# Altium schematic sheet CT_v02.SchDoc
size 420 x 297 mm; DrawnBy: Рулько В.; SheetNumber: 1; SheetTotal: 1; Title1str: Вимірювач струму; PageSetup: Record=PageOptions|CenterHorizontal=False|CenterVertical=False|PrintScale=0.95|XCorrection=0.00|YCorrection=0.00|PrintKind=1|BorderSize=5000000|LeftOffset=0|BottomOffset=0|Orientation=1|PaperLength=1000|PaperWidth=1000|Scale=100|PaperSource=15|PrintQuality=600|MediaType=1|DitherType=10|PaperKind=A4|PrintScaleMode=1; Title2str: широкодіапазонний; DocumentType1str: Схема електрична; DocumentType2str: принципрва; ProjectNameForBOM: Вимірювач струму широкодіапазонний
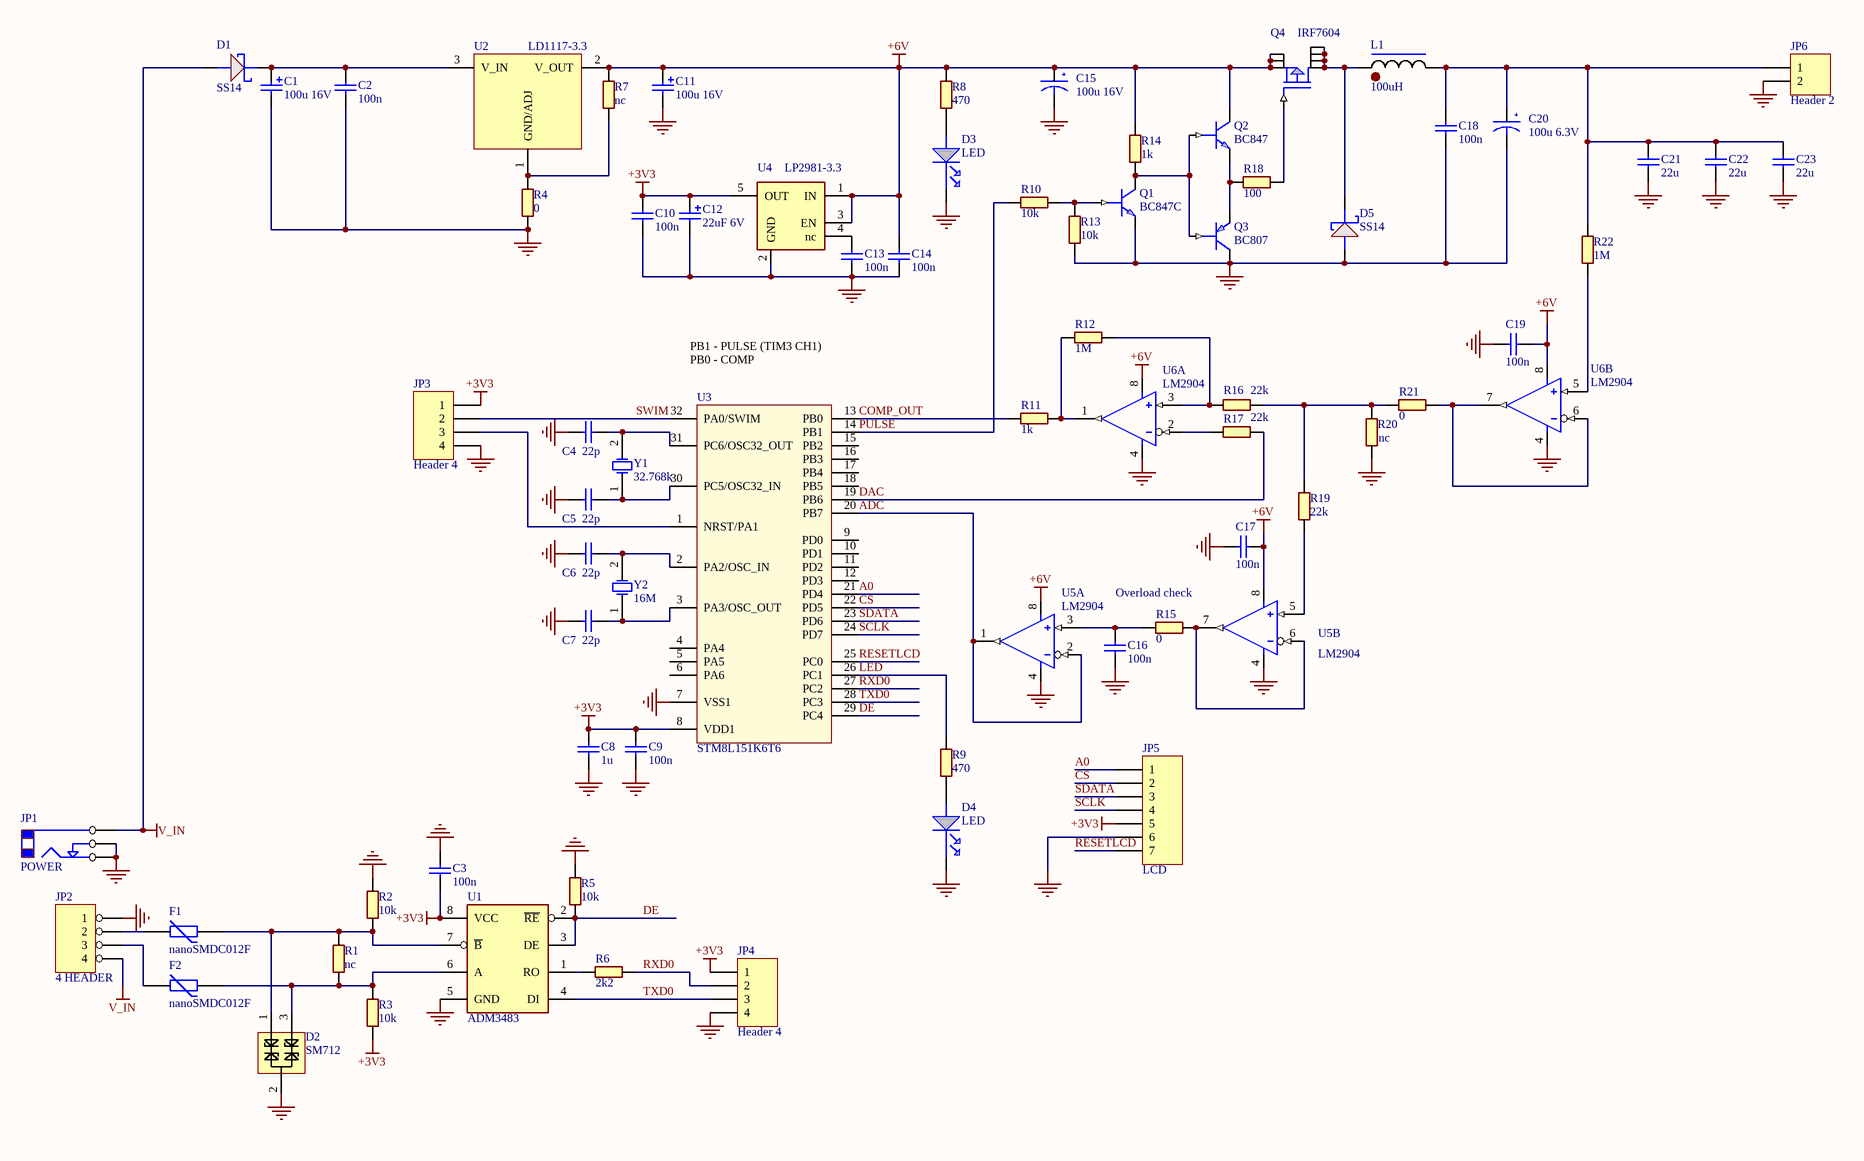
[diagram p0: CT_v02.SchDoc]

## Parts
C1  100u 16V  [C_TANTAL_D]
C2  100n  [C-0603]
C3  100n  [C-0603]
C4  22p  [C-0603]
C5  22p  [C-0603]
C6  22p  [C-0603]
C7  22p  [C-0603]
C8  1u  [C-0603]
C9  100n  [C-0603]
C10  100n  [C-0603]
C11  100u 16V  [C_TANTAL_D]
C12  22uF 6V  [C_TANTAL_A]
C13  100n  [C-0603]
C14  100n  [C-0603]
C15  100u 16V  [C_TANTAL_D]
C16  100n  [C-0603]
C17  100n  [C-0603]
C18  100n  [C-0603]
C19  100n  [C-0603]
C20  100u 6.3V  [C_TANTAL_B]
C21  22u  [C-1206]
C22  22u  [C-1206]
C23  22u  [C-1206]
D1  SS14  [D-SMA]
D2  SM712  [SOT-23]
D3  LED  [LED_0805]
D4  LED  [LED_0805]
D5  SS14  [D-SMA]
F1  nanoSMDC012F  [R-1206]
F2  nanoSMDC012F  [R-1206]
JP1  POWER  [DC-140-003_3]
JP2  4 HEADER  [TERMINAL4_3]
JP3  Header 4  [PLS1-4]
JP4  Header 4  [PLS1-4]
JP5  LCD  [PLS1-7]
JP6  Header 2  [TERMINAL2_1]
L1  100uH  [SND-0705_3]
Q1  BC847C  [SOT-23]
Q2  BC847  [SOT-23]
Q3  BC807  [SOT-23]
Q4  IRF7604  [SSOP-8]
R1  nc  [R-0603]
R2  10k  [R-0603]
R3  10k  [R-0603]
R4  0  [R-0603]
R5  10k  [R-0603]
R6  2k2  [R-0603]
R7  nc  [R-0603]
R8  470  [R-0603]
R9  470  [R-0603]
R10  10k  [R-0603]
R11  1k  [R-0603]
R12  1M  [R-0603]
R13  10k  [R-0603]
R14  1k  [R-0603]
R15  0  [R-0603]
R16  22k  [R-0603]
R17  22k  [R-0603]
R18  100  [R-0603]
R19  22k  [R-0603]
R20  nc  [R-0603]
R21  0  [R-0603]
R22  1M  [R-0603]
U1  ADM3483  [SO-8]
U2  LD1117-3.3  [SOT223]
U3  STM8L151K6T6  [QFP-32]
U4  LP2981-3.3  [SOT-23-5]
U5  LM2904  [SO-8]  (parts A,B of 2)
U6  LM2904  [SO-8]  (parts A,B of 2)
Y1  32.768k  [KX26]
Y2  16M  [HC49_3.5mm]

## Nets
+3V3: C3.2 C8.1 C9.1 C10.1 C12.2 JP3.1 JP4.1 JP5.5 R3.2 U1.8(VCC) U3.8(VDD1) U4.5(OUT)
+6V: C11.2 C14.1 C15.2(+) C17.2 C19.2 Q2.2(COLLECTOR) Q4.1(SOURCE) Q4.2(SOURCE) Q4.3(SOURCE) R7.2 R8.1 R14.2 U2.2(V_OUT) U4.1(IN) U4.3(EN) U5.8(V+) U6.8(V+)
GND: C1.1 C2.2 C3.1 C4.1 C5.1 C6.1 C7.1 C8.2 C9.2 C10.2 C11.1 C12.1 C13.2 C14.2 C15.1(-) C16.2 C17.1 C18.2 C19.1 C20.1(-) C21.2 C22.2 C23.2 D2.2 D3.K(CATHODE) D4.K(CATHODE) D5.A JP1.2(C) JP1.3(B) JP2.1 JP3.4 JP4.4 JP5.6 JP6.2 Q1.3(EMITTER) Q3.2(COLLECTOR) R2.2 R4.1 R5.1 R13.2 R20.2 U1.5(GND) U3.7(VSS1) U4.2(GND) U5.4(V-) U6.4(V-)
V_IN: D1.A JP1.1(A) JP2.4
A0: JP5.1 U3.21(PD4)
ADC: U3.20(PB7) U5.1(OUT) U5.2(-IN)
COMP_OUT: R11.2 U3.13(PB0)
CS: JP5.2 U3.22(PD5)
DAC: R17.1 U3.19(PB6)
DE: R5.2 U1.2(~{RE}) U1.3(DE) U3.29(PC4)
LED: R9.1 U3.26(PC1)
PULSE: R10.2 U3.14(PB1)
RESETLCD: JP5.7 U3.25(PC0)
RXD0: JP4.2 R6.1 U3.27(PC2)
SCLK: JP5.4 U3.24(PD7)
SDATA: JP5.3 U3.23(PD6)
SWIM: JP3.2 U3.32(PA0/SWIM)
TXD0: JP4.3 U1.4(DI) U3.28(PC3)
NetC1_2: C1.2 C2.1 D1.K U2.3(V_IN)
NetC4_2: C4.2 U3.31(PC6/OSC32_OUT) Y1.2(OSC2)
NetC5_2: C5.2 U3.30(PC5/OSC32_IN) Y1.1(OSC1)
NetC6_2: C6.2 U3.2(PA2/OSC_IN) Y2.2(OSC2)
NetC7_2: C7.2 U3.3(PA3/OSC_OUT) Y2.1(OSC1)
NetC13_1: C13.1 U4.4(nc)
NetC16_1: C16.1 R15.2 U5.3(+IN)
NetC18_1: C18.1 C20.2(+) C21.1 C22.1 C23.1 JP6.1 L1.2 R22.2
NetD2_1: D2.1 F1.2 R1.1 R2.1 U1.7(~{B})
NetD2_3: D2.3 F2.2 R1.2 R3.1 U1.6(A)
NetD3_A: D3.A(ANODE) R8.2
NetD4_A: D4.A(ANODE) R9.2
NetD5_K: D5.K L1.1 Q4.5(DRAIN) Q4.6(DRAIN) Q4.7(DRAIN) Q4.8(DRAIN)
NetF1_1: F1.1 JP2.2
NetF2_1: F2.1 JP2.3
NetJP3_3: JP3.3 U3.1(NRST/PA1)
NetQ1_1: Q1.1(BASE) R10.1 R13.1
NetQ1_2: Q1.2(COLLECTOR) Q2.1(BASE) Q3.1(BASE) R14.1
NetQ2_3: Q2.3(EMITTER) Q3.3(EMITTER) R18.2
NetQ4_4: Q4.4(GATE) R18.1
NetR4_2: R4.2 R7.1 U2.1(GND/ADJ)
NetR6_2: R6.2 U1.1(RO)
NetR11_1: R11.1 R12.2 U6.1(OUT)
NetR12_1: R12.1 R16.2 U6.3(+IN)
NetR15_1: R15.1 U5.6(-IN) U5.7(OUT)
NetR16_1: R16.1 R19.1 R20.1 R21.2
NetR17_2: R17.2 U6.2(-IN)
NetR19_2: R19.2 U5.5(+IN)
NetR21_1: R21.1 U6.6(-IN) U6.7(OUT)
NetR22_1: R22.1 U6.5(+IN)

Not connected (* = marked no-connect by the designer): U3 4(PA4) 5(PA5) 6(PA6) 9(PD0) 10(PD1) 11(PD2) 12(PD3) 15(PB2) 16(PB3) 17(PB4) 18(PB5)

## Notes on the sheet
- (near U3) PB1 - PULSE (TIM3 CH1)
  PB0 - COMP
- Overload check
- Перв. примен.
- Справ. №
- Подп. и дата
- Инв. № дубл.
- Взам. инв. №
- Изм.
- Лист
- № докум.
- Подп.
- Дата
- Лит.
- Масса
- Масштаб
- Т.контр.
- Пров.
- Разраб.
- Листов
- Инв. № подл.
- Н.контр.
- Утв.
- Копировал
- Формат А3

## Library data of the parts
C1 C11 C12 = CAPP: Вид: Конденсатор
  C1 C11: Номінал: 100u 16V; Корпус: C_TANTAL_D
  C12: Корпус: C_TANTAL_A; Номінал: 22uF 6V
C2 C3 C8-C10 C13 C14 C16-C19 C21-C23 = CAPN: Вид: Конденсатор; Точність/група: X7R
  C2: Номінал: 100n; Корпус: C-0603
  C3 C9 C10 C13 C14 C16-C19: Корпус: C-0603; Номінал: 100n
  C8: Корпус: C-0603; Номінал: 1u
  C21-C23: Корпус: C-1206; Номінал: 22u
C4-C7 = CAPN: Вид: Конденсатор; Точність/група: NP0; Корпус: C-0603; Номінал: 22p
C15 C20 = C-EL-DIP: Вид: Конденсатор; Точність/група: *
  C15: Корпус: C_TANTAL_D; Номінал: 100u 16V
  C20: Корпус: C_TANTAL_B; Номінал: 100u 6.3V
D1 D5 = DIODE SCHOTTKY: Вид: Діод; Корпус: D-SMA; Номінал: SS14
D2 = SM712: Вид: Діод; Корпус: SOT-23; Номінал: SM712
D3 D4 = LED: Вид: Діод; Корпус: LED_0805; Номінал: LED
F1 F2 = VARISTOR: Вид: Термозапобіжник; Корпус: R-1206; Номінал: nanoSMDC012F
JP1 = POWER: Вид: Роз'єм; *: *; Корпус: DC-140-003_3; Номінал: POWER
JP2 = 4 HEADER: 4 Pin Header; Вид: Роз'єм; *: *; Корпус: TERMINAL4_3; Номінал: 4 HEADER
JP3 JP4 = Header 4: Header, 4-Pin; Вид: Роз'єм; Корпус: PLS1-4; Номінал: Header 4
JP5 = Header 7: Header, 7-Pin; Вид: Роз'єм; Корпус: PLS1-7; Номінал: LCD
JP6 = Header 2: Header, 2-Pin; Вид: Роз'єм; Корпус: TERMINAL2_1; Номінал: Header 2
L1 = L*: Вид: Індуктивність; Корпус: SND-0705_3; Номінал: 100uH
Q1 Q2 = NPN: Вид: Транзистор; Корпус: SOT-23
  Q1: Номінал: BC847C
  Q2: Номінал: BC847
Q3 = PNP: Вид: Транзистор; Корпус: SOT-23; Номінал: BC807
Q4 = MOSFET_P_8pins: Вид: Транзистор; Корпус: SSOP-8; Номінал: IRF7604
R1-R22 = RES: Вид: Резистор; Точність/група: 5%; Корпус: R-0603
  R1 R7 R20: Номінал: nc
  R2 R3 R5 R10 R13: Номінал: 10k
  R4 R15 R21: Номінал: 0
  R6: Номінал: 2k2
  R8 R9: Номінал: 470
  R11 R14: Номінал: 1k
  R12 R22: Номінал: 1M
  R16 R17 R19: Номінал: 22k
  R18: Номінал: 100
U1 = SN65HVD12DG4: Вид: Мікросхема; Корпус: SO-8; Номінал: ADM3483
U2 = LM1117_3.3: Вид: Мікросхема; Номінал: LD1117-3.3; Корпус: SOT223
U3 = STM8L151K6T6: Вид: Мікросхема; Корпус: QFP-32; Номінал: STM8L151K6T6
U4 = LP2981-3.3: Вид: Мікросхема; Корпус: SOT-23-5; Номінал: LP2981-3.3
U5 U6 = LM2904: 2 Operation amplifier; Вид: Мікросхема; Корпус: SO-8; Номінал: LM2904
Y1 Y2 = XTAL: Crystal Oscillator; Вид: Кварц
  Y1: Корпус: KX26; Номінал: 32.768k
  Y2: Корпус: HC49_3.5mm; Номінал: 16M